# EAGLE design eagle-schematic (EAGLE 9.6.2)
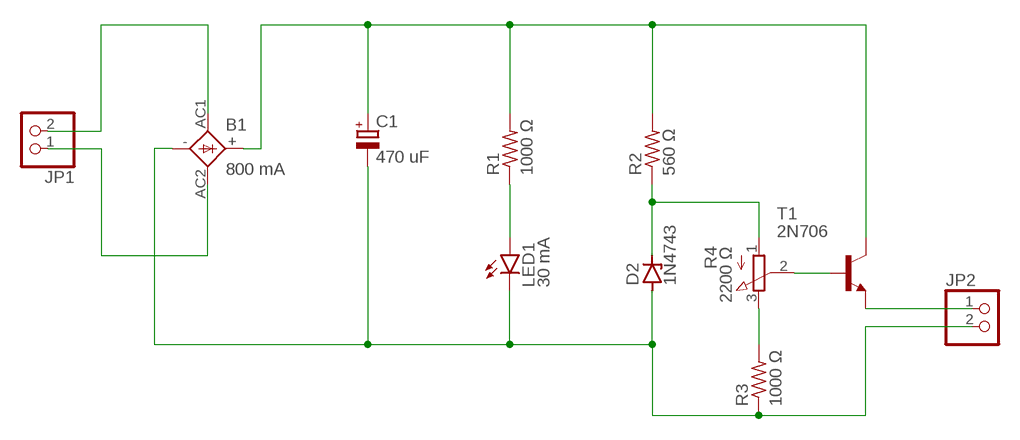
[diagram p0: schematic, sheet 1]

## Parts
B1  800 mA  1KAB  [1KAB]
C1  470 uF  CPOL-EUE3.5-10  [E3,5-10]
D2  1N4743  ZENER-DIODEZD-12.5  [ZDIO12.5]
JP1  PINHD-1X2  [1X02]
JP2  PINHD-1X2  [1X02]
LED1  30 mA  LED5MM  [LED5MM]
R1  1000 Ω  R-US_0309/12  [0309/12]
R2  560 Ω  R-US_0309/12  [0309/12]
R3  1000 Ω  R-US_0309/12  [0309/12]
R4  2200 Ω  3RP/1610N  [3RP/1610N]
T1  2N706  [TO18]

## Nets
N$1: B1.AC1 JP1.2
N$2: B1.AC2 JP1.1
N$3: B1.+ C1.+ R1.2 R2.2 T1.3(C)
N$4: B1.- C1.- D2.A JP2.2 LED1.K(C) R3.1
N$5: LED1.A R1.1
N$6: D2.C R2.1 R4.1(A)
N$7: R3.2 R4.3(E)
N$8: R4.2(S) T1.2(B)
N$9: JP2.1 T1.1(E)

## Library data of the parts
B1 = rectifier:1KAB: RECTIFIER grid 5,08 x 5,08 mm
C1 = rcl:CPOL-EU: POLARIZED CAPACITOR, European symbol; SPICEPREFIX: C
D2 = diode:ZENER-DIODE: Z-Diode
JP1 JP2 = pinhead:PINHD-1X2: PIN HEADER
LED1 = led:LED: LED OSRAM: - CHIPLED LG R971, LG N971, LY N971, LG Q971, LY Q971, LO R971, LY R971 LH N974, LH R974 LS Q976, LO Q976, LY Q976 LO Q996 - Hyper CHIPLED LW Q18S LB Q993, LB Q99A, LB R99A - SideLED LS A670, LO A670, LY A670, LG A670, LP A670 LB A673, LV A673, LT A673, LW A673 LH A674 LY A675 LS A676, LA A676, LO A676, LY A676, LW A676 LS A679, LY A679, LG A679 - Hyper Micro SIDELED® LS Y876, LA Y876, LO Y876, LY Y876 LT Y87S - SmartLED LW L88C, LW L88S LB L89C, LB L89S, LG L890 LS L89K, LO L89K, LY L89K LS L896, LA L896, LO L896, LY L896 - TOPLED LS T670, LO T670, LY T670, LG T670, LP T670 LSG T670, LSP T670, LSY T670, LOP T670, LYG T670 LG T671, LOG T671, LSG T671 LB T673, LV T673, LT T673, LW T673 LH T674 LS T676, LA T676, LO T676, LY T676, LB T676, LH T676, LSB T676, LW T676 LB T67C, LV T67C, LT T67C, LS T67K, LO T67K, LY T67K, LW E67C LS E67B, LA E67B, LO E67B, LY E67B, LB E67C, LV E67C, LT E67C LW T67C LS T679, LY T679, LG T679 LS T770, LO T770, LY T770, LG T770, LP T770 LB T773, LV T773, LT T773, LW T773 LH T774 LS E675, LA E675, LY E675, LS T675 LS T776, LA T776, LO T776, LY T776, LB T776 LHGB T686 LT T68C, LB T68C - Hyper Mini TOPLED® LB M676 - Mini TOPLED Santana® LG M470 LS M47K, LO M47K, LY M47K Source: http://www.osram.convergy.de LUXEON: - LUMILED® LXK2-PW12-R00, LXK2-PW12-S00, LXK2-PW14-U00, LXK2-PW14-V00 LXK2-PM12-R00, LXK2-PM12-S00, LXK2-PM14-U00 LXK2-PE12-Q00, LXK2-PE12-R00, LXK2-PE12-S00, LXK2-PE14-T00, LXK2-PE14-U00 LXK2-PB12-K00, LXK2-PB12-L00, LXK2-PB12-M00, LXK2-PB14-N00, LXK2-PB14-P00, LXK2-PB14-Q00 LXK2-PR12-L00, LXK2-PR12-M00, LXK2-PR14-Q00, LXK2-PR14-R00 LXK2-PD12-Q00, LXK2-PD12-R00, LXK2-PD12-S00 LXK2-PH12-R00, LXK2-PH12-S00 LXK2-PL12-P00, LXK2-PL12-Q00, LXK2-PL12-R00 Source: www.luxeon.com KINGBRIGHT: KA-3528ASYC Source: www.kingbright.com
R1-R3 = rcl:R-US_: RESISTOR, American symbol; SPICEPREFIX: R
R4 = pot:3RP/1610N: 16mm Potentiometer one level Source: http://www.alphapotentiometers.net/html/16mm_pot_2.html
T1 = transistor:2N706: NPN TRANSISTOR

## Board
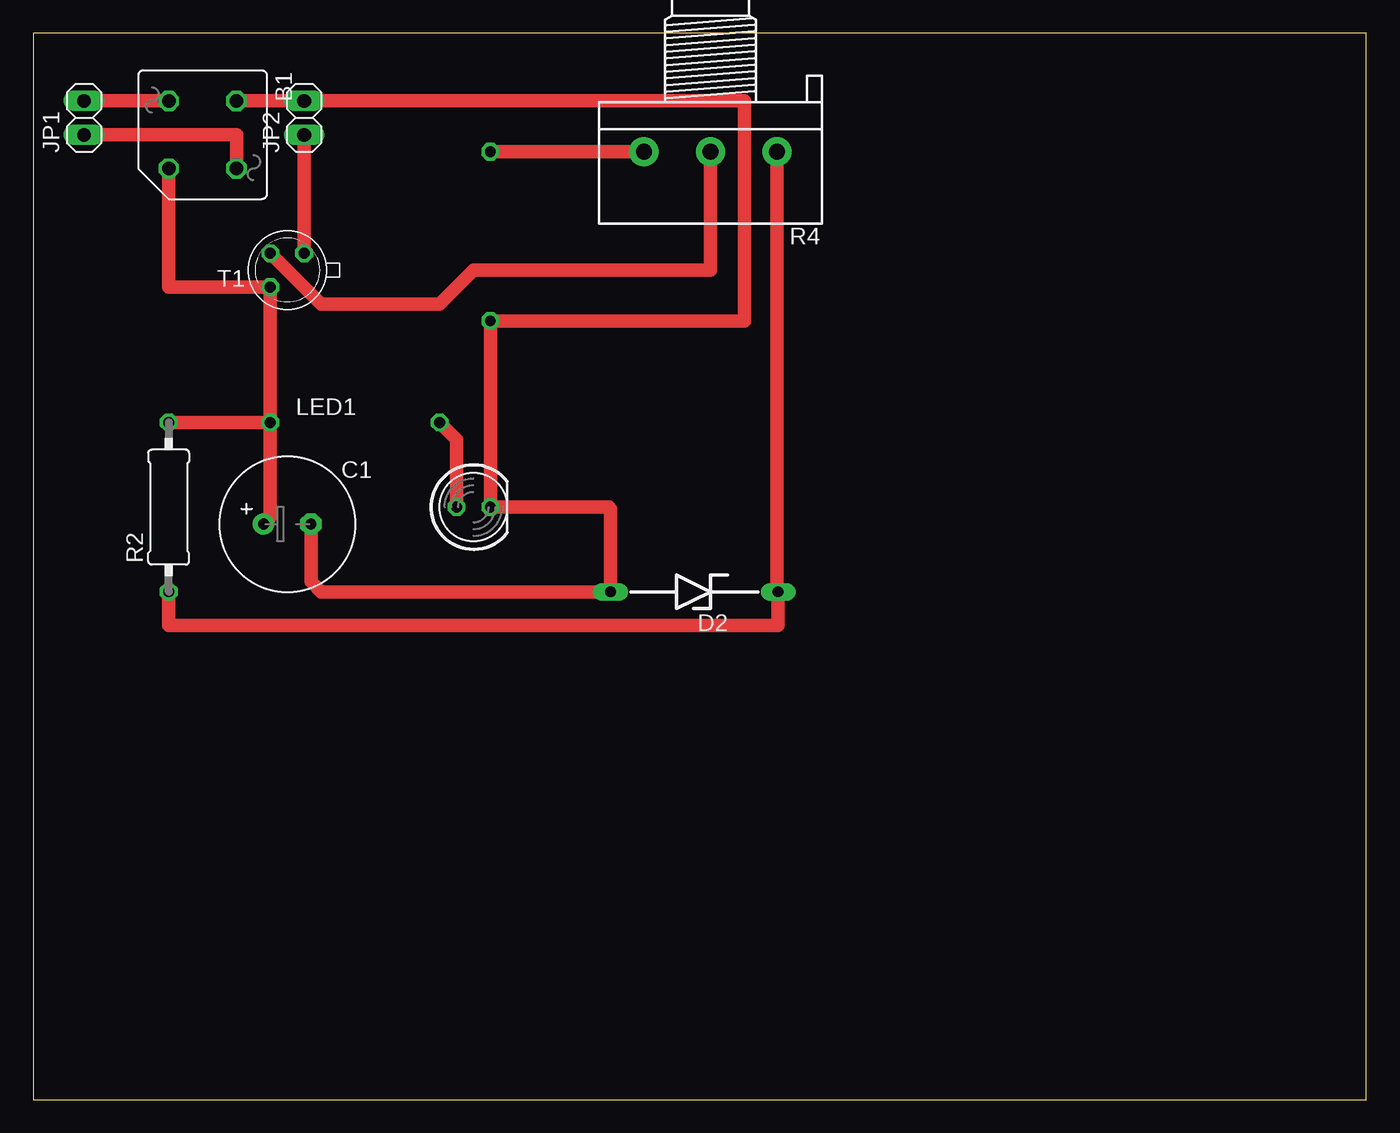
[diagram p1: board, top side]
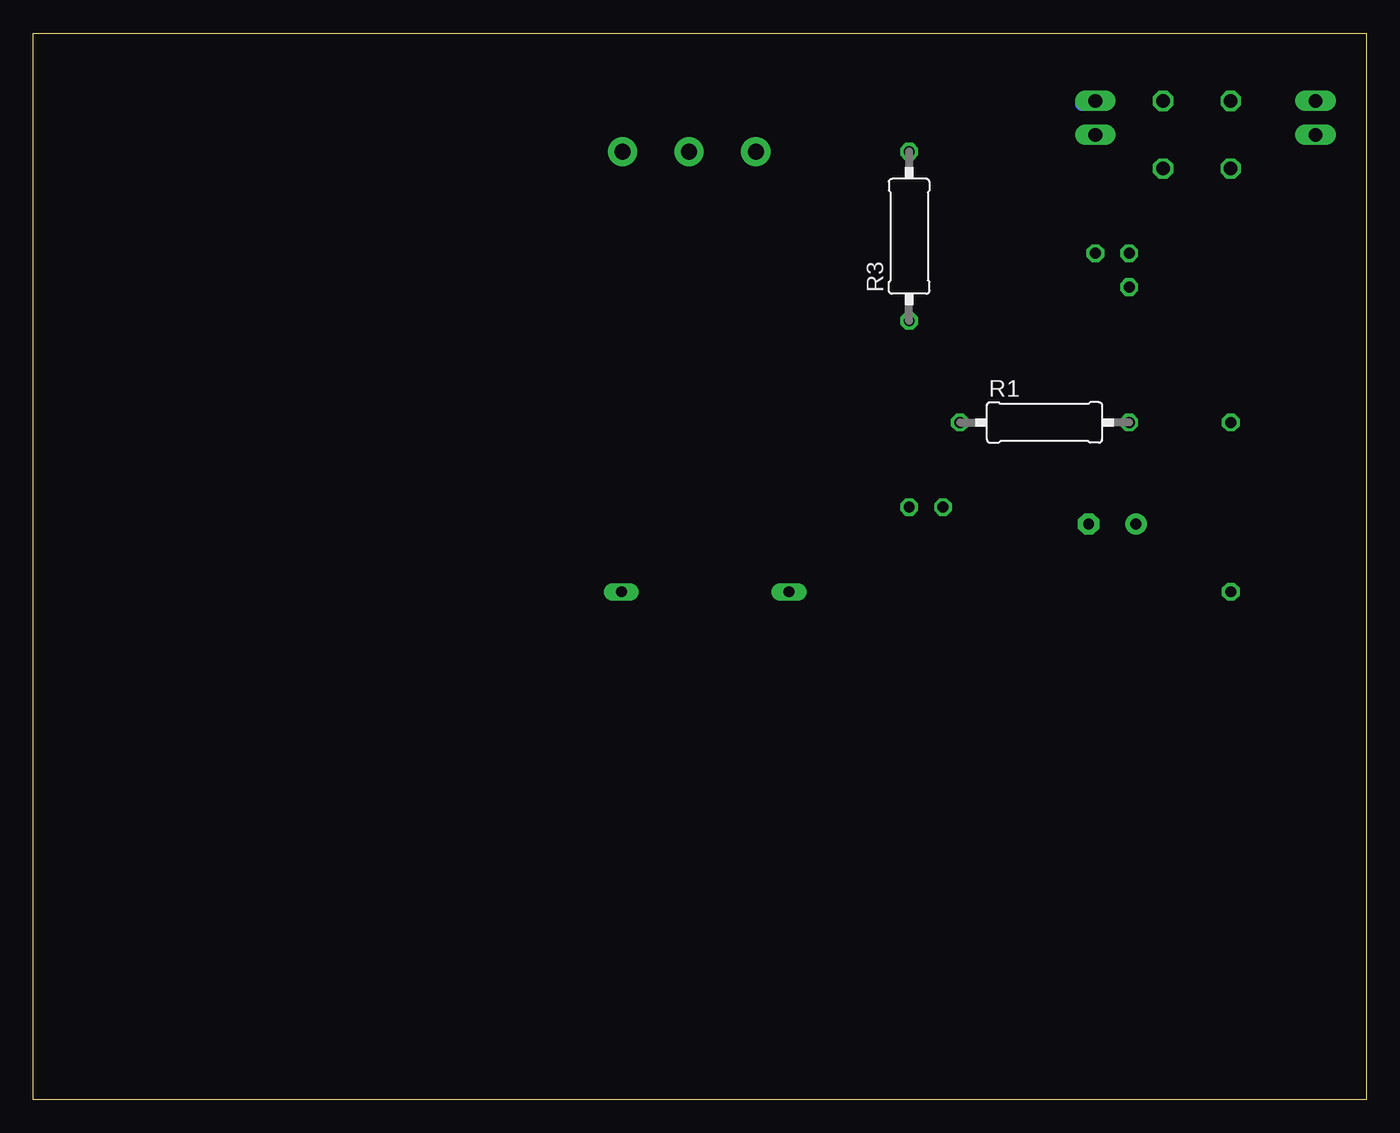
[diagram p2: board, bottom side, seen from below]

Size 100 x 80 mm. Coordinates in mm from the lower left corner, seen from the top.
Outline: 0,0 100,0 100,80 0,80 0,0
Copper layers (1*16): Top 0.035mm / dielectric 1.5mm / Bottom 0.035mm
Design rules "default *": minimum track width 40mil, minimum drill 0.35mm, track to track 20mil, track to pad 6mil, pad to pad 6mil, via to via 6mil, smd to smd 6mil, copper to edge 40mil, drill to drill 6mil, minimum pad ring 10mil, minimum via ring 8mil, stop-mask expansion 4mil, vias tented up to drill 0mil, thermal gap 10mil

### Footprints (pad centres in the part's own frame; a part is rotated, then mirrored left to right if it is on the bottom)
1KAB = drill 1.016 octagon: + 2.54,-2.54; - -2.54,2.54; AC1 -2.54,-2.54; AC2 2.54,2.54
E3,5-10 = drill 0.813 pad 1.6: + -1.778,0 | drill 0.813 pad 1.6 octagon: - 1.778,0
ZDIO12.5 = drill 0.813 long: A 6.223,0; C -6.35,0
1X02 = drill 1.016 long: 1 -1.27,0; 2 1.27,0
LED5MM = drill 0.813 octagon: A -1.27,0; K 1.27,0
0309/12 = drill 0.813 octagon: 1 -6.35,0; 2 6.35,0
3RP/1610N = drill 1.2 pad 2.184: 1 -5,0; 2 0,0; 3 5,0
TO18 = drill 0.813 octagon: 1 -1.27,-1.27; 2 1.27,-1.27; 3 1.27,1.27

### Placement (x,y rotation side)
B1  12.7,72.39 270 top
C1  19.05,43.18 0 top
D2  49.53,38.1 180 top
JP1  3.81,73.66 90 top
JP2  20.32,73.66 90 top
LED1  33.02,44.45 0 top
R1  24.13,50.8 0 bottom
R2  10.16,44.45 90 top
R3  34.29,64.77 90 bottom
R4  50.8,71.12 180 top
T1  19.05,62.23 180 top

### Tracks (layer width: path | path; a pad name or v marks a point on that pad's centre or on a via)
N$1
  Top 1.016: JP1.2 B1.AC1
N$2
  Top 1.016: JP1.1 15.24,72.39 B1.AC2
N$3
  Top 1.016: B1.+ 10.16,60.96 T1.3 R1.2 | C1.+ 17.78,43.69 R1.2 | R1.2 R2.2
N$4
  Top 1.016: C1.- 20.83,38.86 21.59,38.1 D2.A 43.31,44.32 43.18,44.45 LED1.K R3.1 53.34,58.42 53.34,74.93 JP2.2 B1.-
  Bottom 1.016: 42.67,38.1 D2.A | 21.34,74.68 20.57,74.68 JP2.2
N$5
  Top 1.016: LED1.A 31.75,49.53 R1.1
N$6
  Top 1.016: R4.1 55.8,38.18 D2.C 55.88,35.56 10.16,35.56 R2.1
N$7
  Top 1.016: R3.2 R4.3
N$8
  Top 1.016: R4.2 50.8,62.23 33.02,62.23 30.48,59.69 21.59,59.69 T1.2
N$9
  Top 1.016: T1.1 JP2.1